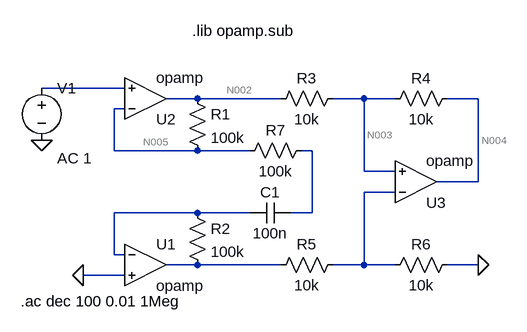
[diagram p0: schematic Draft1.asc]
Draft1.asc, the LTspice schematic file:
Version 4.1
SHEET 1 880 680
WIRE 160 -32 32 -32
WIRE 272 -16 224 -16
WIRE 400 -16 272 -16
WIRE 528 -16 480 -16
WIRE 576 -16 528 -16
WIRE 704 -16 656 -16
WIRE 160 0 144 0
WIRE 144 64 144 0
WIRE 272 64 144 64
WIRE 352 64 272 64
WIRE 448 64 432 64
WIRE 528 96 528 -16
WIRE 576 96 528 96
WIRE 704 112 704 -16
WIRE 704 112 640 112
WIRE 576 128 528 128
WIRE 272 160 144 160
WIRE 352 160 272 160
WIRE 448 160 448 64
WIRE 448 160 416 160
WIRE 144 224 144 160
WIRE 160 224 144 224
WIRE 272 240 224 240
WIRE 400 240 272 240
WIRE 528 240 528 128
WIRE 528 240 480 240
WIRE 576 240 528 240
WIRE 704 240 656 240
WIRE 160 256 96 256
FLAG 96 256 0
FLAG 32 48 0
FLAG 704 240 0
SYMBOL OpAmps\\opamp 192 176 R0
SYMATTR InstName U1
SYMBOL OpAmps\\opamp 192 48 M180
SYMATTR InstName U2
SYMBOL res 256 -32 R0
SYMATTR InstName R1
SYMATTR Value 100k
SYMBOL res 256 144 R0
SYMATTR InstName R2
SYMATTR Value 100k
SYMBOL voltage 32 -48 R0
WINDOW 123 24 124 Left 2
WINDOW 39 0 0 Left 0
SYMATTR InstName V1
SYMATTR Value ""
SYMATTR Value2 AC 1
SYMBOL res 496 -32 R90
WINDOW 0 0 56 VBottom 2
WINDOW 3 32 56 VTop 2
SYMATTR InstName R3
SYMATTR Value 10k
SYMBOL res 672 -32 R90
WINDOW 0 0 56 VBottom 2
WINDOW 3 32 56 VTop 2
SYMATTR InstName R4
SYMATTR Value 10k
SYMBOL res 496 224 R90
WINDOW 0 0 56 VBottom 2
WINDOW 3 32 56 VTop 2
SYMATTR InstName R5
SYMATTR Value 10k
SYMBOL res 672 224 R90
WINDOW 0 0 56 VBottom 2
WINDOW 3 32 56 VTop 2
SYMATTR InstName R6
SYMATTR Value 10k
SYMBOL OpAmps\\opamp 608 176 M180
SYMATTR InstName U3
SYMBOL res 448 48 R90
WINDOW 0 0 56 VBottom 2
WINDOW 3 32 56 VTop 2
SYMATTR InstName R7
SYMATTR Value 100k
SYMBOL cap 416 144 R90
WINDOW 0 0 32 VBottom 2
WINDOW 3 32 32 VTop 2
SYMATTR InstName C1
SYMATTR Value 100n
TEXT 0 296 Left 2 !.ac dec 100 0.01 1Meg
TEXT 264 -120 Left 2 !.lib opamp.sub

The netlist it stands for:
* Draft1.asc
X§U1 N008 0 N009 opamp Aol=100K GBW=10Meg  ; pins invin noninvin out
X§U2 N005 N001 N002 opamp Aol=100K GBW=10Meg  ; pins invin noninvin out
R1 N002 N005 100k
R2 N008 N009 100k
V1 N001 0 AC 1
R3 N003 N002 10k
R4 N004 N003 10k
R5 N007 N009 10k
R6 0 N007 10k
X§U3 N007 N003 N004 opamp Aol=100K GBW=10Meg  ; pins invin noninvin out
R7 N006 N005 100k
C1 N006 N008 100n
.ac dec 100 0.01 1Meg
.lib opamp.sub
.backanno
.end

* Results of the author's LTspice run, read from the files saved beside the schematic
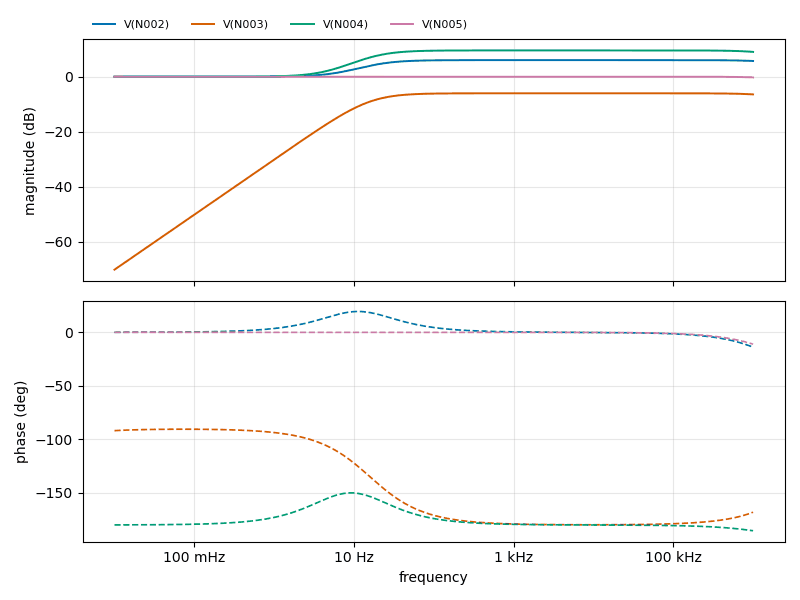
[diagram p1: AC Analysis of Draft1.asc, plotted from the saved traces]
* AC Analysis, 1 run:
*   V(N002): -0.00 dB at 10 mHz, 5.70 dB at 1 MHz, peak 6.02 dB at 7.079 kHz, 3 dB below the peak at 11.25 Hz
*   V(N003): -70.05 dB at 10 mHz, -6.42 dB at 1 MHz, peak -6.02 dB at 7.079 kHz, 3 dB below the peak at 15.92 Hz
*   V(N004): 0.00 dB at 10 mHz, 9.00 dB at 1 MHz, peak 9.54 dB at 6.457 kHz, 3 dB below the peak at 14.04 Hz
*   V(N005): -0.00 dB at 10 mHz, -0.25 dB at 1 MHz, peak -0.00 dB at 10 mHz